# EAGLE design guitar_pedal_adapter (EAGLE 8.5.2)
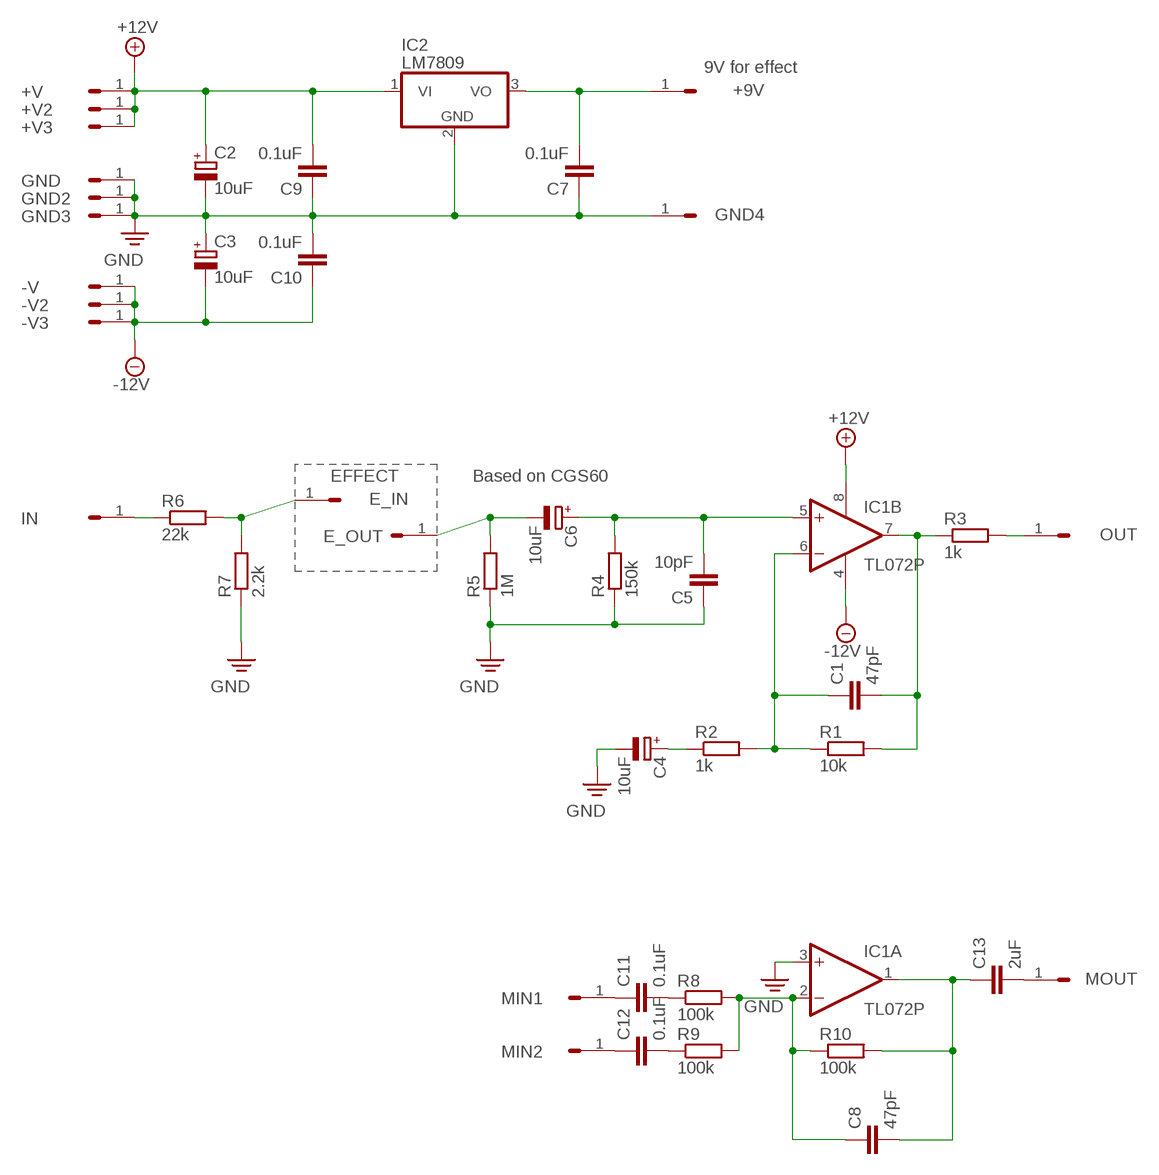
[diagram p0: schematic, sheet 1]

## Parts
+9V  HEADER/MALE/01  [HEADER/MALE/01]
+V  HEADER/MALE/01  [HEADER/MALE/01]
+V2  HEADER/MALE/01  [HEADER/MALE/01]
+V3  HEADER/MALE/01  [HEADER/MALE/01]
-V  HEADER/MALE/01  [HEADER/MALE/01]
-V2  HEADER/MALE/01  [HEADER/MALE/01]
-V3  HEADER/MALE/01  [HEADER/MALE/01]
C1  47pF  CAPACITORCERAMICDISC/5  [CERAMICDISC/5]
C2  10uF  CAPACITOR/POLARIZEDE2.5-6  [E2,5-6]
C3  10uF  CAPACITOR/POLARIZEDE2.5-6  [E2,5-6]
C4  10uF  CAPACITOR/POLARIZEDE2.5-6  [E2,5-6]
C5  10pF  CAPACITORCERAMICDISC/5  [CERAMICDISC/5]
C6  10uF  CAPACITOR/POLARIZEDE2.5-6  [E2,5-6]
C7  0.1uF  CAPACITORCERAMICDISC/5  [CERAMICDISC/5]
C8  47pF  CAPACITORCERAMICDISC/5  [CERAMICDISC/5]
C9  0.1uF  CAPACITORCERAMICDISC/5  [CERAMICDISC/5]
C10  0.1uF  CAPACITORCERAMICDISC/5  [CERAMICDISC/5]
C11  0.1uF  CAPACITORCERAMICDISC/5  [CERAMICDISC/5]
C12  0.1uF  CAPACITORCERAMICDISC/5  [CERAMICDISC/5]
C13  2uF  CAPACITORCERAMICDISC/5  [CERAMICDISC/5]
E_IN  HEADER/MALE/01  [HEADER/MALE/01]
E_OUT  HEADER/MALE/01  [HEADER/MALE/01]
GND  HEADER/MALE/01  [HEADER/MALE/01]
GND2  HEADER/MALE/01  [HEADER/MALE/01]
GND3  HEADER/MALE/01  [HEADER/MALE/01]
GND4  HEADER/MALE/01  [HEADER/MALE/01]
IC1  TL072P  [DIL08]
IC2  LM7809  7805TV  [TO220V]
IN  HEADER/MALE/01  [HEADER/MALE/01]
MIN1  HEADER/MALE/01  [HEADER/MALE/01]
MIN2  HEADER/MALE/01  [HEADER/MALE/01]
MOUT  HEADER/MALE/01  [HEADER/MALE/01]
OUT  HEADER/MALE/01  [HEADER/MALE/01]
R1  10k  RESISTORRESISTOR/UPRIGHT/7.5  [RESISTOR/7.5]
R2  1k  RESISTORRESISTOR/UPRIGHT/7.5  [RESISTOR/7.5]
R3  1k  RESISTORRESISTOR/UPRIGHT/7.5  [RESISTOR/7.5]
R4  150k  RESISTORRESISTOR/UPRIGHT/7.5  [RESISTOR/7.5]
R5  1M  RESISTORRESISTOR/UPRIGHT/7.5  [RESISTOR/7.5]
R6  22k  RESISTORRESISTOR/UPRIGHT/7.5  [RESISTOR/7.5]
R7  2.2k  RESISTORRESISTOR/UPRIGHT/7.5  [RESISTOR/7.5]
R8  100k  RESISTORRESISTOR/UPRIGHT/7.5  [RESISTOR/7.5]
R9  100k  RESISTORRESISTOR/UPRIGHT/7.5  [RESISTOR/7.5]
R10  100k  RESISTORRESISTOR/UPRIGHT/7.5  [RESISTOR/7.5]

## Nets
+12V: +V2.1 +V3.1 +V.1 C2.+ C9.2 IC1.8(P:V+) IC2.1(VI)
-12V: -V2.1 -V3.1 -V.1 C3.- C10.1 IC1.4(P:V-)
GND: C2.- C3.+ C4.- C5.1 C7.1 C9.1 C10.2 GND2.1 GND3.1 GND4.1 GND.1 IC1.3(A:+IN) IC2.2(GND) R4.1 R5.1 R7.1
N$1: C1.2 IC1.7(B:OUT) R1.2 R3.1
N$2: C1.1 IC1.6(B:-IN) R1.1 R2.2
N$3: C4.+ R2.1
N$4: C5.2 C6.+ IC1.5(B:+IN) R4.2
N$5: E_IN.1 R6.2 R7.2
N$6: IN.1 R6.1
N$7: C6.- E_OUT.1 R5.2
N$8: +9V.1 C7.2 IC2.3(VO)
N$9: OUT.1 R3.2
N$10: C8.1 IC1.2(A:-IN) R8.2 R9.2 R10.1
N$11: C8.2 C13.1 IC1.1(A:OUT) R10.2
N$12: C13.2 MOUT.1
N$13: C11.2 R8.1
N$14: C12.2 R9.1
N$15: C11.1 MIN1.1
N$16: C12.1 MIN2.1

## Notes on the sheet
- 9V for effect
- EFFECT | Based on CGS60

## Library data of the parts
+9V +V +V2 +V3 -V -V2 -V3 E_IN E_OUT GND GND2-GND4 IN MIN1 MIN2 MOUT OUT = connectors:HEADER/MALE/01; SPICEPREFIX: X
C1 C5 C7-C13 = capacitors:CAPACITOR: CAPACITOR, European symbol
C2-C4 C6 = capacitors:CAPACITOR/POLARIZED: POLARIZED CAPACITOR, European symbol; SPICEPREFIX: C
IC1 = ic_analogue:TL072: OP AMP
IC2 = ic_voltage_reg:78*: Positive VOLTAGE REGULATOR Source: http://cache.national.com/ds/LM/LM78L05.pdf http://www.fairchildsemi.com/ds/LM/LM7805.pdf
R1-R10 = resistors:RESISTOR: RESISTOR, European symbol

## Board
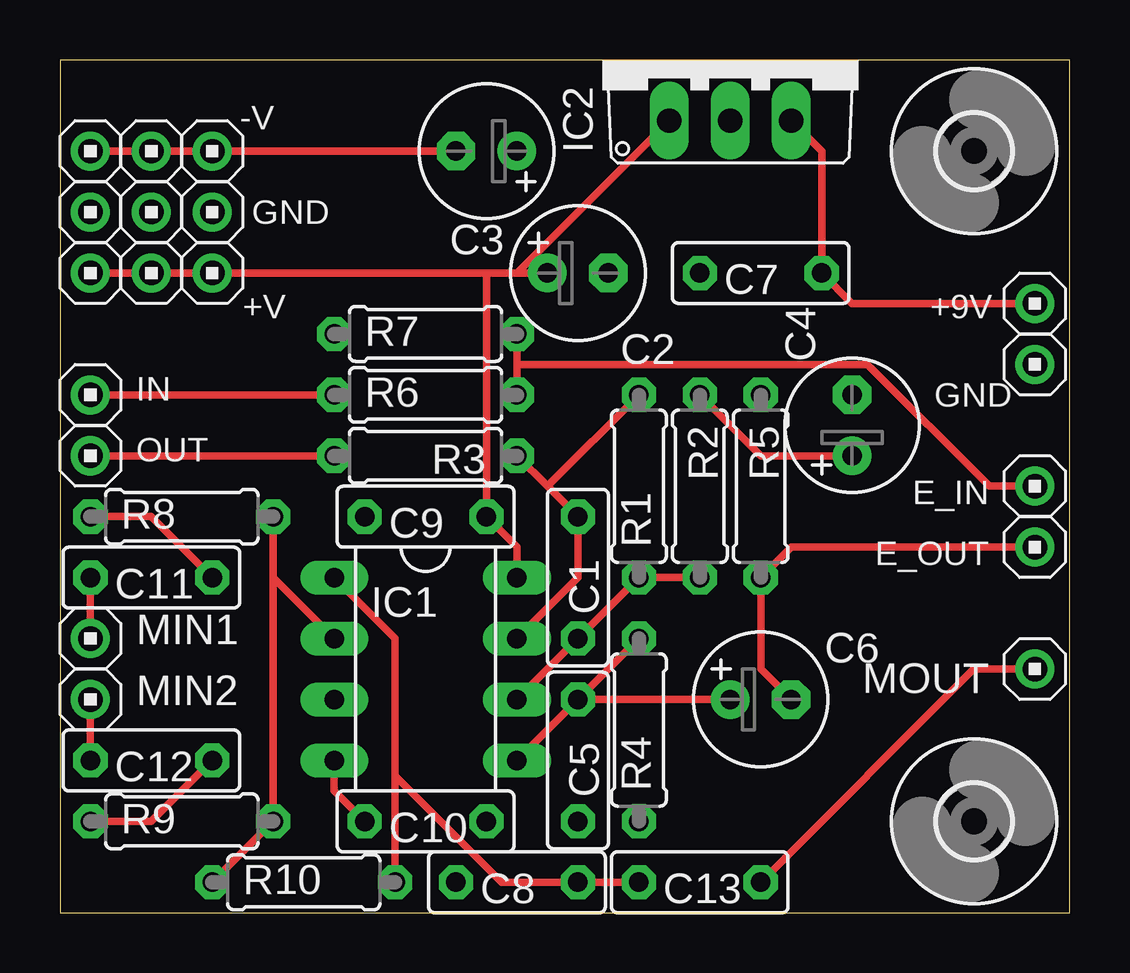
[diagram p1: board, top side]
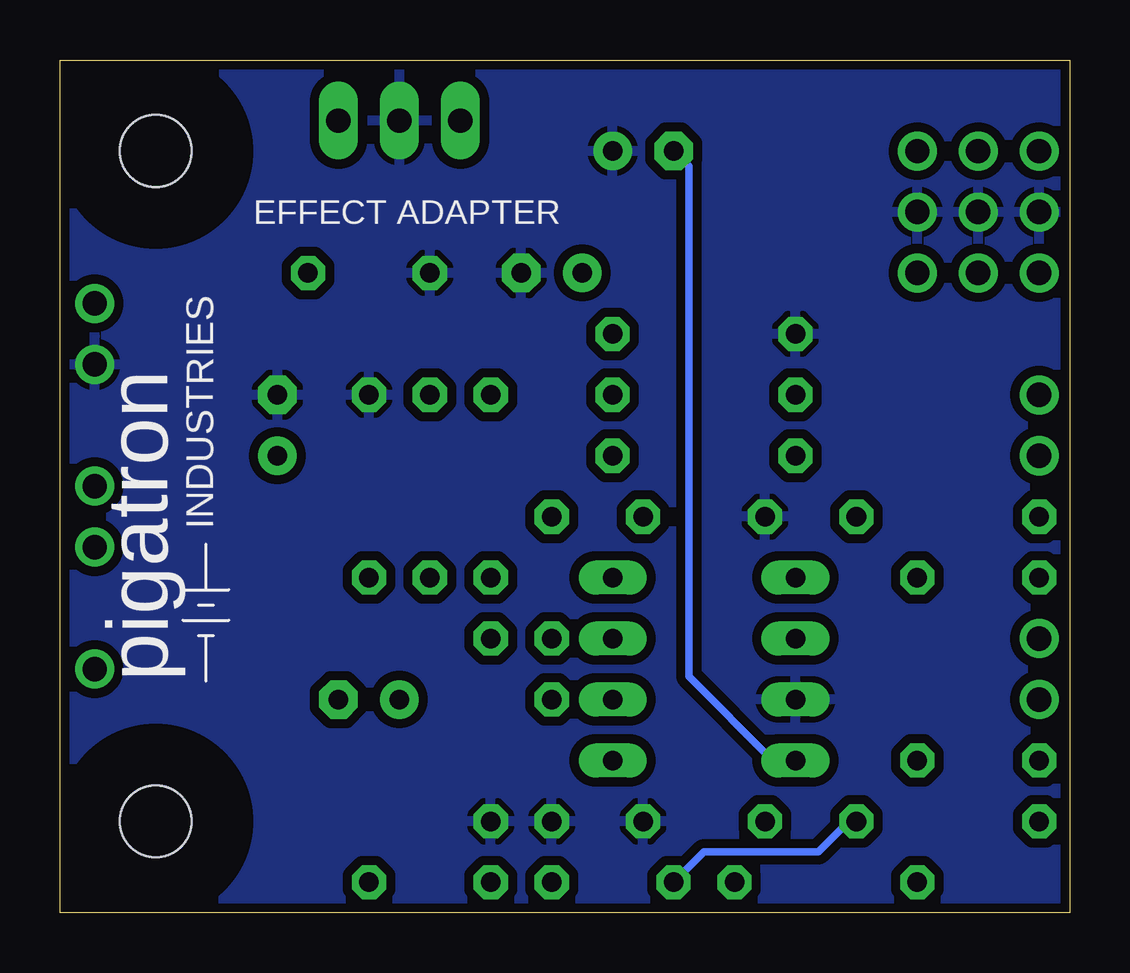
[diagram p2: board, bottom side, seen from below]

Size 42.09 x 35.55 mm. Coordinates in mm from the lower left corner, seen from the top.
Outline: 0,0 42.09,0 42.09,35.55 0,35.55 0,0
Copper layers (1*16): Top 0.0356mm / dielectric 1.5011mm / Bottom 0.0356mm
Design rules "rob": minimum track width 12mil, minimum drill 13mil, track to track 15mil, track to pad 10mil, pad to pad 10mil, via to via 10mil, smd to smd 6mil, copper to edge 15mil, drill to drill 10mil, minimum pad ring 12mil, minimum via ring 10mil, stop-mask expansion 4mil, vias tented up to drill 0mil, thermal gap 10mil

### Footprints (pad centres in the part's own frame; a part is rotated, then mirrored left to right if it is on the bottom)
HEADER/MALE/01 = drill 1.016: 1 0,0
CERAMICDISC/5 = drill 0.813 octagon: 1 -2.54,0; 2 2.54,0
E2,5-6 = drill 0.813 pad 1.6: + -1.27,0 | drill 0.813 pad 1.6 octagon: - 1.27,0
DIL08 = drill 0.813 pad 1.27 long: 1 -3.81,-3.81; 2 -1.27,-3.81; 3 1.27,-3.81; 4 3.81,-3.81; 5 3.81,3.81; 6 1.27,3.81; 7 -1.27,3.81; 8 -3.81,3.81
TO220V = drill 1.016 long: 1 -2.54,-2.54; 2 0,-2.54; 3 2.54,-2.54
RESISTOR/7.5 = drill 0.813 octagon: 1 -3.81,0; 2 3.81,0
STANDOFF/3.0 = hole 3: 0,0

### Placement (x,y rotation side)
+9V  40.64,25.4 180 top
+V  1.27,26.67 0 top
+V2  3.81,26.67 0 top
+V3  6.35,26.67 0 top
-V  1.27,31.75 0 top
-V2  3.81,31.75 0 top
-V3  6.35,31.75 0 top
C1  21.59,13.97 90 top
C2  21.59,26.67 0 top
C3  17.78,31.75 180 top
C4  33.02,20.32 90 top
C5  21.59,6.35 90 top
C6  29.21,8.89 0 top
C7  29.21,26.67 0 top
C8  19.05,1.27 0 top
C9  15.24,16.51 0 top
C10  15.24,3.81 0 top
C11  3.81,13.97 0 top
C12  3.81,6.35 0 top
C13  26.67,1.27 0 top
E_IN  40.64,17.78 180 top
E_OUT  40.64,15.24 180 top
GND  1.27,29.21 0 top
GND2  3.81,29.21 0 top
GND3  6.35,29.21 0 top
GND4  40.64,22.86 0 top
IC1  15.24,10.16 270 top
IC2  27.94,35.56 0 top
IN  1.27,21.59 0 top
MIN1  1.27,11.43 0 top
MIN2  1.27,8.89 0 top
MOUT  40.64,10.16 180 top
OUT  1.27,19.05 0 top
R1  24.13,17.78 90 top
R2  26.67,17.78 270 top
R3  15.24,19.05 180 top
R4  24.13,7.62 90 top
R5  29.21,17.78 270 top
R6  15.24,21.59 0 top
R7  15.24,24.13 0 top
R8  5.08,16.51 0 top
R9  5.08,3.81 0 top
R10  10.16,1.27 0 top
U$1  [STANDOFF/3.0]  38.1,3.81 0 top
U$2  [STANDOFF/3.0]  38.1,31.75 0 top
U$3  [PIGATRON-LOGO]  37.59,18.54 90 bottom

### Tracks (layer width: path | path; a pad name or v marks a point on that pad's centre or on a via)
+12V
  Top 0.305: IC1.8 19.05,15.24 C9.2 17.78,26.67 | +V.1 +V2.1 +V3.1 17.78,26.67 | 17.78,26.67 19.05,26.67 | 19.05,26.67 C2.+ | 19.05,26.67 IC2.1
-12V
  Top 0.305: IC1.4 11.43,5.08 C10.1 | -V.1 -V2.1 -V3.1 C3.-
  Bottom 0.305: IC1.4 12.38,6.35 15.88,9.84 15.88,31.11 C3.-
GND
  pour Bottom: 0,0 41.91,0 41.91,35.56 0,35.56
N$1
  Top 0.305: IC1.7 21.59,13.97 C1.2 20.32,17.78 | 20.32,17.78 R3.1 | 20.32,17.78 R1.2
N$2
  Top 0.305: R2.2 R1.1 C1.1 IC1.6
N$3
  Top 0.305: R2.1 29.21,19.05 C4.+
N$4
  Top 0.305: C5.2 IC1.5 | C5.2 R4.2 | C5.2 C6.+
N$5
  Top 0.305: R7.2 19.05,22.86 | 19.05,22.86 R6.2 | E_IN.1 38.73,17.78 33.66,22.86 19.05,22.86
N$6
  Top 0.305: IN.1 R6.1
N$7
  Top 0.305: C6.- 29.21,10.16 R5.2 30.48,15.24 E_OUT.1
N$8
  Top 0.305: IC2.3 31.75,31.75 C7.2 33.02,25.4 +9V.1
N$9
  Top 0.305: OUT.1 R3.2
N$10
  Top 0.305: R10.1 R9.2 8.89,13.97 | 8.89,13.97 IC1.2 | R8.2 8.89,13.97
  Bottom 0.305: C8.1 15.24,2.54 10.48,2.54 9.21,3.81 R9.2
N$11
  Top 0.305: C13.1 C8.2 18.41,1.27 13.97,5.71 | 13.97,5.71 13.97,11.43 IC1.1 | 13.97,5.71 R10.2
N$12
  Top 0.305: C13.2 38.1,10.16 MOUT.1
N$13
  Top 0.305: R8.1 3.81,16.51 C11.2
N$14
  Top 0.305: R9.1 3.81,3.81 C12.2
N$15
  Top 0.305: MIN1.1 C11.1
N$16
  Top 0.305: MIN2.1 C12.1

### Text on the board
tNames: GND
bNames: EFFECT ADAPTER